# EAGLE design RFID_Controller (EAGLE 7.2.0)
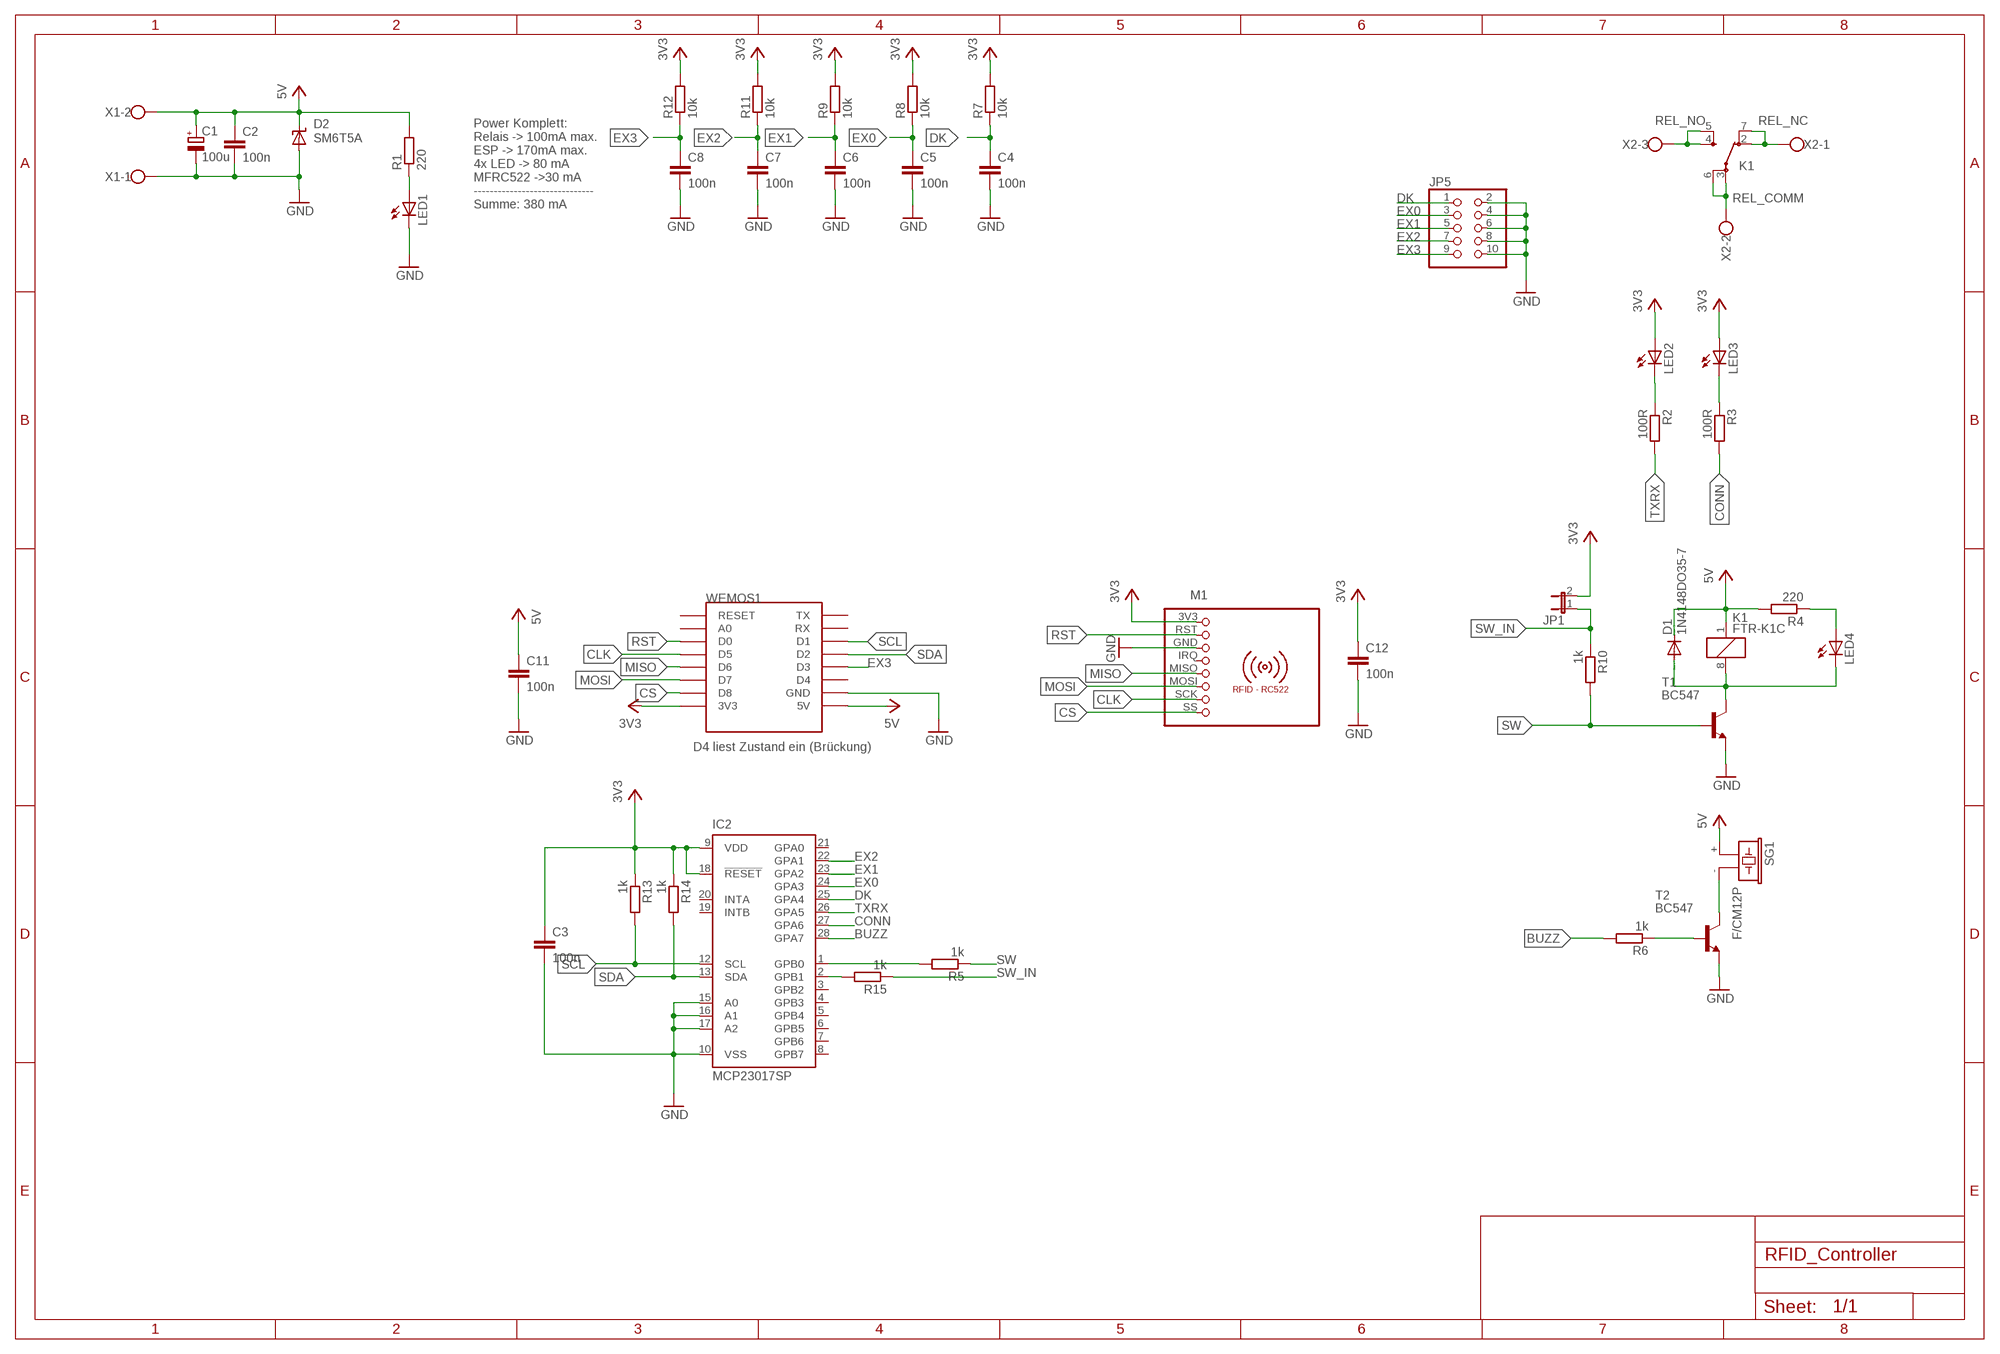
[diagram p0: schematic, sheet 1]

## Parts
C1  100u  CPOL-EUE2.5-7  [E2,5-7]
C2  100n  C-EU050-025X075  [C050-025X075]
C3  100n  C-EU050-025X075  [C050-025X075]
C4  100n  C-EU050-025X075  [C050-025X075]
C5  100n  C-EU050-025X075  [C050-025X075]
C6  100n  C-EU050-025X075  [C050-025X075]
C7  100n  C-EU050-025X075  [C050-025X075]
C8  100n  C-EU050-025X075  [C050-025X075]
C11  100n  C-EU050-025X075  [C050-025X075]
C12  100n  C-EU050-025X075  [C050-025X075]
D1  1N4148DO35-7  [DO35-7]
D2  SM6T5A  SUPPRESSOR-SMBJ  [SMBJ]
IC2  MCP23017SP  [DIL28-3]
JP1  JP1E  [JP1]
JP5  PINHD-2X5  [2X05]
K1  FTR-K1C  [FTR-K1C]
LED1  LED3MM  [LED3MM]
LED2  LED3MM  [LED3MM]
LED3  LED3MM  [LED3MM]
LED4  LED3MM  [LED3MM]
M1  RFID-RC522  [RFID-RC522]
R1  220  R-EU_0204/7  [0204/7]
R2  100R  R-EU_0204/7  [0204/7]
R3  100R  R-EU_0204/7  [0204/7]
R4  220  R-EU_0204/7  [0204/7]
R5  1k  R-EU_0204/7  [0204/7]
R6  1k  R-EU_0204/7  [0204/7]
R7  10k  R-EU_0204/7  [0204/7]
R8  10k  R-EU_0204/7  [0204/7]
R9  10k  R-EU_0204/7  [0204/7]
R10  1k  R-EU_0204/7  [0204/7]
R11  10k  R-EU_0204/7  [0204/7]
R12  10k  R-EU_0204/7  [0204/7]
R13  1k  R-EU_0204/7  [0204/7]
R14  1k  R-EU_0204/7  [0204/7]
R15  1k  R-EU_0204/7  [0204/7]
SG1  F/CM12P  [F/CM12P]
T1  BC547  [TO92]
T2  BC547  [TO92]
WEMOS1  WEMOS-D1-MINI  [WEMOS-D1-MINI]
X1  W237-102  [W237-102]
X2  W237-103  [W237-103]

## Nets
3V3: C3.1 C12.1 IC2.9(VDD) IC2.18(!RESET) JP1.2 LED2.A LED3.A M1.3V3 R7.2 R8.2 R9.2 R11.2 R12.2 R13.1 R14.1 WEMOS1.3V3
5V: C1.+ C2.1 C11.1 D1.C D2.C K1.1 R1.2 R4.2 SG1.+ WEMOS1.5V X1.2
BUZZ: IC2.28(GPA7) R6.2
CLK: M1.SCK WEMOS1.D5
CONN: IC2.27(GPA6) R3.2
CS: M1.SS WEMOS1.D8
DK: C4.1 IC2.25(GPA4) JP5.1 R7.1
EX0: C5.1 IC2.24(GPA3) JP5.3 R8.1
EX1: C6.1 IC2.23(GPA2) JP5.5 R9.1
EX2: C7.1 IC2.22(GPA1) JP5.7 R11.1
EX3: C8.1 JP5.9 R12.1 WEMOS1.D3
GND: C1.- C2.2 C3.2 C4.2 C5.2 C6.2 C7.2 C8.2 C11.2 C12.2 D2.A IC2.10(VSS) IC2.15(A0) IC2.16(A1) IC2.17(A2) JP5.2 JP5.4 JP5.6 JP5.8 JP5.10 LED1.K(C) M1.GND T1.1(E) T2.1(E) WEMOS1.GND X1.1
MISO: M1.MISO WEMOS1.D6
MOSI: M1.MOSI WEMOS1.D7
N$1: LED1.A R1.1
N$2: LED2.K(C) R2.1
N$3: LED3.K(C) R3.1
N$4: LED4.A R4.1
N$5: D1.A K1.8 LED4.K(C) T1.3(C)
N$6: R6.1 T2.2(B)
N$7: SG1.- T2.3(C)
N$8: IC2.1(GPB0) R5.2
N$9: IC2.2(GPB1) R15.2
REL_COMM [HV]: K1.3(-1:PA) K1.6(-1:PB) X2.2
REL_NC [HV]: K1.2(-1:OA) K1.7(-1:OB) X2.1
REL_NO [HV]: K1.4(-1:SA) K1.5(-1:SB) X2.3
RST: M1.RST WEMOS1.D0
SCL: IC2.12(SCL) R13.2 WEMOS1.D1
SDA: IC2.13(SDA) R14.2 WEMOS1.D2
SW: R5.1 R10.2 T1.2(B)
SW_IN: JP1.1 R10.1 R15.1
TXRX: IC2.26(GPA5) R2.2
Unconnected: IC2.3(GPB2) IC2.4(GPB3) IC2.5(GPB4) IC2.6(GPB5) IC2.7(GPB6) IC2.8(GPB7) IC2.19(INTB) IC2.20(INTA) IC2.21(GPA0) M1.IRQ WEMOS1.A0 WEMOS1.D4 WEMOS1.RESET WEMOS1.RX WEMOS1.TX

## Notes on the sheet
- Power Komplett:
  Relais -> 100mA max.
  ESP -> 170mA max.
  4x LED -> 80 mA
  MFRC522 ->30 mA
  ------------------------------
  Summe: 380 mA
- D4 liest Zustand ein (Brückung)

## Library data of the parts
C1 = rcl:CPOL-EU: POLARIZED CAPACITOR, European symbol
C2-C8 C11 C12 = rcl:C-EU: CAPACITOR, European symbol
D1 = diode:1N4148: DIODE high speed (Philips)
D2 = diode:SUPPRESSOR-: Suppressor diode
IC2 = microchip:MCP23017: http://ww1.microchip.com/downloads/en/DeviceDoc/21952a.pdf Source: http://ww1.microchip.com/downloads/en/DeviceDoc/21952a.pdf; MF: MICROCHIP; MPN: MCP23017-E/SP; OC_FARNELL: 1332088; OC_NEWARK: 31K2959
JP1 = jumper:JP1E: JUMPER
JP5 = pinhead:PINHD-2X5: PIN HEADER
K1 = relay:FTR-K1C: NETZRELAIS FTR-K1CK024W1XUM 16A/250VAC 1 Umschaltkontakt Distributor: Conrad Electronic Bestell Nr.: 504389-13 - 24V Source: http://www.produktinfo.conrad.com/datenblaetter/500000-524999/504384-da-01-de-NETZRELAIS_FTR_K1CK012W1XUM_16A_250VAC.pdf; OC_FARNELL: unknown; OC_NEWARK: unknown
LED1-LED4 = led:LED: LED OSRAM: - CHIPLED LG R971, LG N971, LY N971, LG Q971, LY Q971, LO R971, LY R971 LH N974, LH R974 LS Q976, LO Q976, LY Q976 LO Q996 - Hyper CHIPLED LW Q18S LB Q993, LB Q99A, LB R99A - SideLED LS A670, LO A670, LY A670, LG A670, LP A670 LB A673, LV A673, LT A673, LW A673 LH A674 LY A675 LS A676, LA A676, LO A676, LY A676, LW A676 LS A679, LY A679, LG A679 - Hyper Micro SIDELED® LS Y876, LA Y876, LO Y876, LY Y876 LT Y87S - SmartLED LW L88C, LW L88S LB L89C, LB L89S, LG L890 LS L89K, LO L89K, LY L89K LS L896, LA L896, LO L896, LY L896 - TOPLED LS T670, LO T670, LY T670, LG T670, LP T670 LSG T670, LSP T670, LSY T670, LOP T670, LYG T670 LG T671, LOG T671, LSG T671 LB T673, LV T673, LT T673, LW T673 LH T674 LS T676, LA T676, LO T676, LY T676, LB T676, LH T676, LSB T676, LW T676 LB T67C, LV T67C, LT T67C, LS T67K, LO T67K, LY T67K, LW E67C LS E67B, LA E67B, LO E67B, LY E67B, LB E67C, LV E67C, LT E67C LW T67C LS T679, LY T679, LG T679 LS T770, LO T770, LY T770, LG T770, LP T770 LB T773, LV T773, LT T773, LW T773 LH T774 LS E675, LA E675, LY E675, LS T675 LS T776, LA T776, LO T776, LY T776, LB T776 LHGB T686 LT T68C, LB T68C - Hyper Mini TOPLED® LB M676 - Mini TOPLED Santana® LG M470 LS M47K, LO M47K, LY M47K Source: http://www.osram.convergy.de LUXEON: - LUMILED® LXK2-PW12-R00, LXK2-PW12-S00, LXK2-PW14-U00, LXK2-PW14-V00 LXK2-PM12-R00, LXK2-PM12-S00, LXK2-PM14-U00 LXK2-PE12-Q00, LXK2-PE12-R00, LXK2-PE12-S00, LXK2-PE14-T00, LXK2-PE14-U00 LXK2-PB12-K00, LXK2-PB12-L00, LXK2-PB12-M00, LXK2-PB14-N00, LXK2-PB14-P00, LXK2-PB14-Q00 LXK2-PR12-L00, LXK2-PR12-M00, LXK2-PR14-Q00, LXK2-PR14-R00 LXK2-PD12-Q00, LXK2-PD12-R00, LXK2-PD12-S00 LXK2-PH12-R00, LXK2-PH12-S00 LXK2-PL12-P00, LXK2-PL12-Q00, LXK2-PL12-R00 Source: www.luxeon.com KINGBRIGHT: KA-3528ASYC Source: www.kingbright.com
M1 = mfrc522-module:RFID-RC522: RFID-RC522 MFRC-522 based breakout board
R1-R15 = rcl:R-EU_: RESISTOR, European symbol
SG1 = buzzer:F/CM12P: BUZZER Source: Buerklin; OC_FARNELL: unknown; OC_NEWARK: unknown
T1 T2 = transistor:BC547: NPN TRANSISTOR
WEMOS1 = esp8266modules:WEMOS-D1-MINI: WeMos.cc D1 mini ESP8266 module
X1 = con-wago-500:W237-102: WAGO SCREW CLAMP; MPN: 237-102; OC_FARNELL: unknown; OC_NEWARK: 70K9898
X2 = con-wago-500:W237-103: WAGO SCREW CLAMP; MPN: 237-103; OC_FARNELL: unknown; OC_NEWARK: 18M7116

## Net classes
1 HV: clearance 5 mm to class 0, clearance 1 mm

## Board
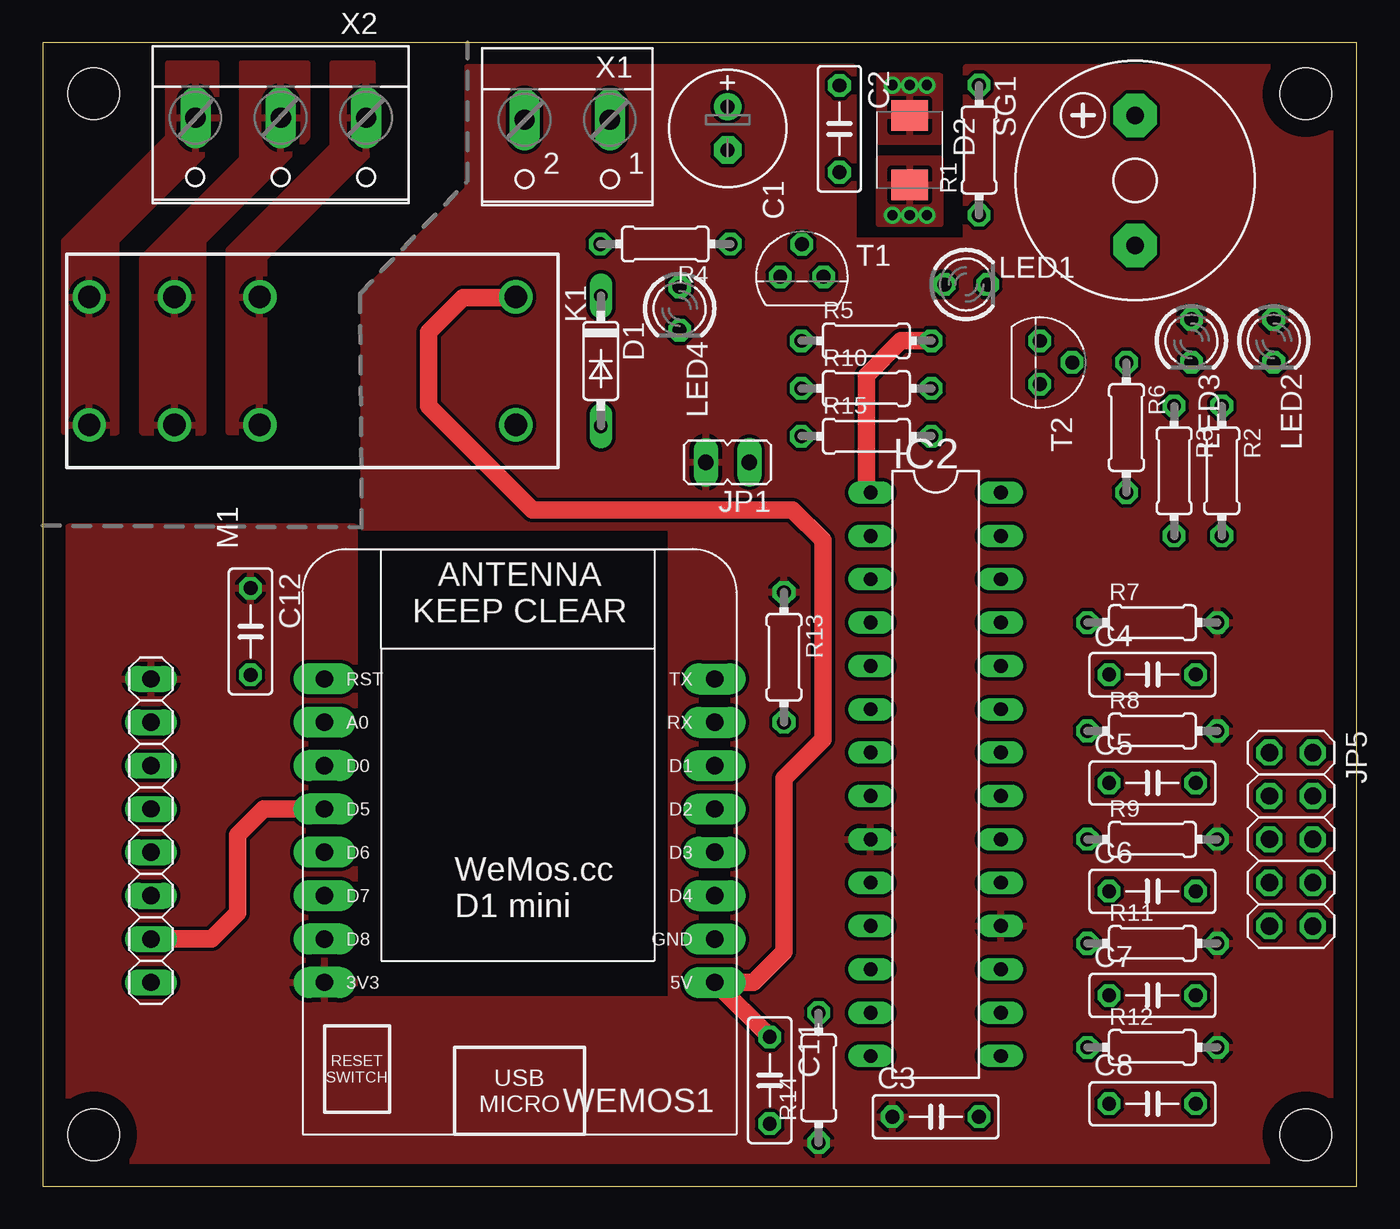
[diagram p1: board, top side]
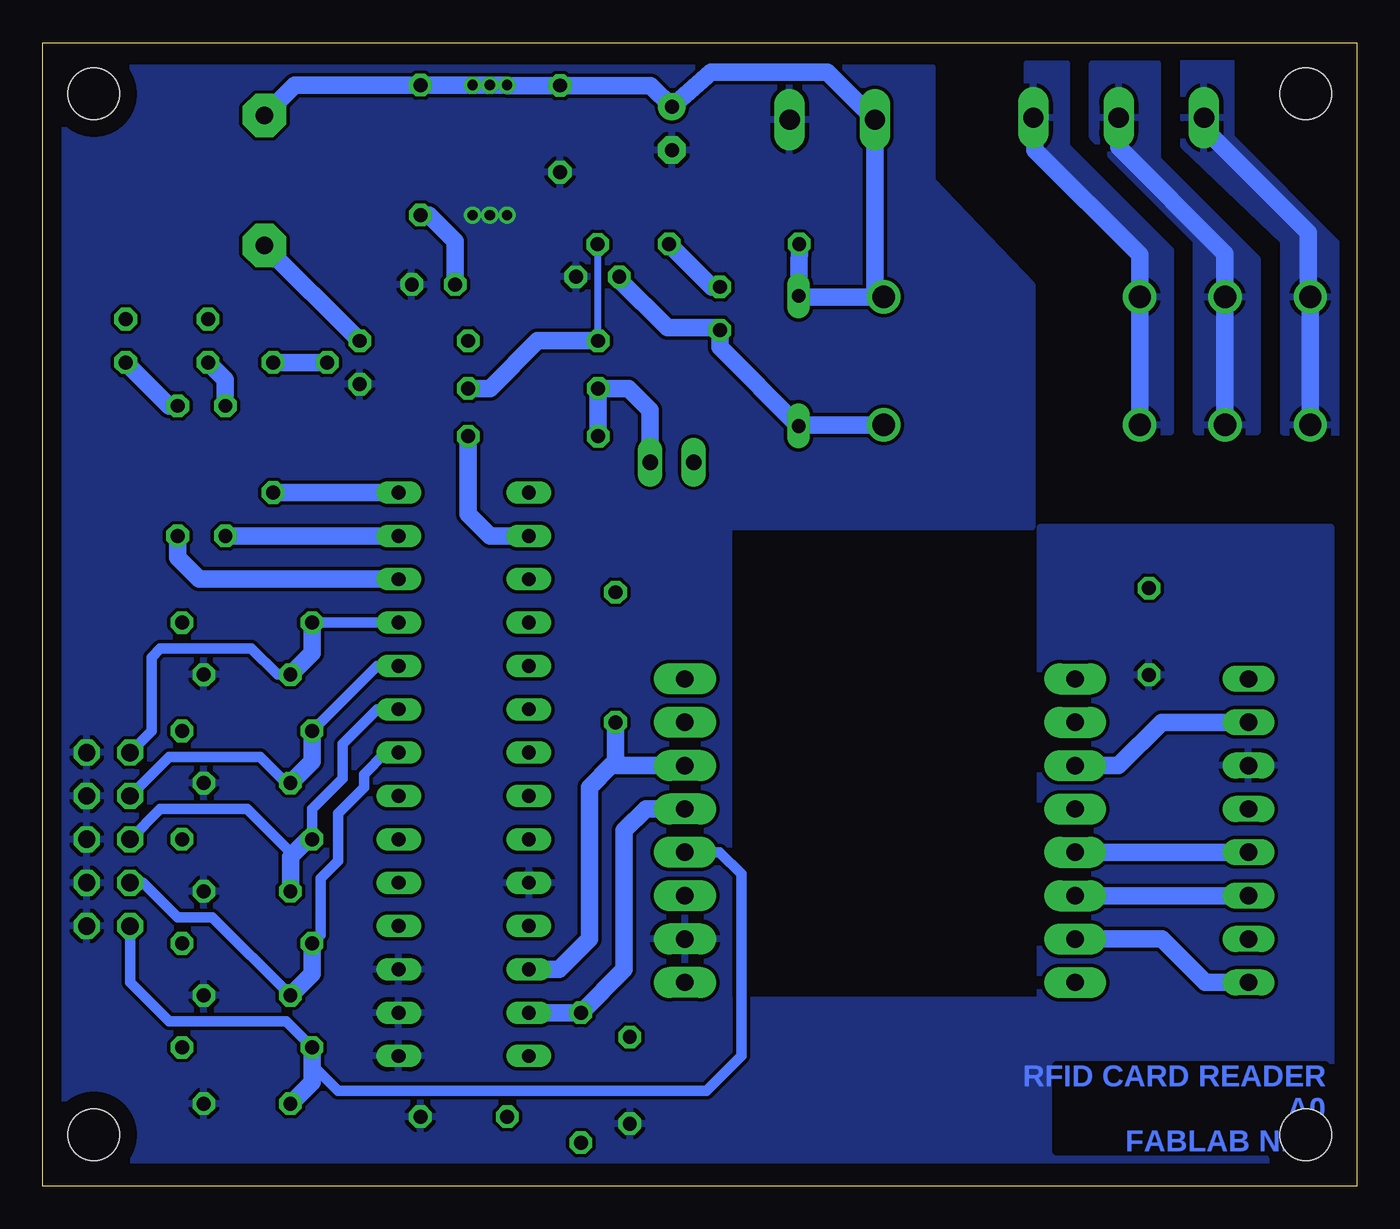
[diagram p2: board, bottom side, seen from below]

Size 77 x 67 mm. Coordinates in mm from the lower left corner, seen from the top.
Outline: 0,0 77,0 77,67 0,67 0,0
Copper layers (1*16): Top 0.035mm / dielectric 1.5mm / Bottom 0.035mm
Design rules "default *": minimum track width 10mil, minimum drill 0.2mm, track to track 8mil, track to pad 8mil, pad to pad 8mil, via to via 8mil, smd to smd 8mil, copper to edge 40mil, drill to drill 8mil, minimum pad ring 10mil, minimum via ring 8mil, stop-mask expansion 4mil, vias tented up to drill 0mil, thermal gap 10mil
Holes 3 mm at 3,64 74,64 74,3 3,3

### Footprints (pad centres in the part's own frame; a part is rotated, then mirrored left to right if it is on the bottom)
E2,5-7 = drill 0.813 pad 1.6: + -1.27,0 | drill 0.813 pad 1.6 octagon: - 1.27,0
C050-025X075 = drill 0.813 octagon: 1 -2.54,0; 2 2.54,0
DO35-7 = drill 0.813 long: A 3.81,0; C -3.81,0
SMBJ = smd 1.78 x 2.16: A 2.04,0; C -2.03,0
DIL28-3 = drill 0.813 long: 1 -16.51,-3.81; 2 -13.97,-3.81; 3 -11.43,-3.81; 4 -8.89,-3.81; 5 -6.35,-3.81; 6 -3.81,-3.81; 7 -1.27,-3.81; 8 1.27,-3.81; 9 3.81,-3.81; 10 6.35,-3.81; 11 8.89,-3.81; 12 11.43,-3.81; 13 13.97,-3.81; 14 16.51,-3.81; 15 16.51,3.81; 16 13.97,3.81; 17 11.43,3.81; 18 8.89,3.81; 19 6.35,3.81; 20 3.81,3.81; 21 1.27,3.81; 22 -1.27,3.81; 23 -3.81,3.81; 24 -6.35,3.81; 25 -8.89,3.81; 26 -11.43,3.81; 27 -13.97,3.81; 28 -16.51,3.81
JP1 = drill 0.914 long: 1 0,-1.27; 2 0,1.27
2X05 = drill 1.016 octagon: 1 -5.08,-1.27; 2 -5.08,1.27; 3 -2.54,-1.27; 4 -2.54,1.27; 5 0,-1.27; 6 0,1.27; 7 2.54,-1.27; 8 2.54,1.27; 9 5.08,-1.27; 10 5.08,1.27
FTR-K1C = drill 1.3 pad 1.93: 1 -12.5,-3.75; 2 2.5,-3.75; 3 7.5,-3.75; 4 12.5,-3.75; 5 12.5,3.75; 6 7.5,3.75; 7 2.5,3.75; 8 -12.5,3.75
LED3MM = drill 0.813 octagon: A -1.27,0; K 1.27,0
RFID-RC522 = drill 1.016 long: 3V3 -8.89,0; GND -3.81,0; IRQ -1.27,0; MISO 1.27,0; MOSI 3.81,0; RST -6.35,0; SCK 6.35,0; SS 8.89,0
0204/7 = drill 0.813 octagon: 1 -3.81,0; 2 3.81,0
F/CM12P = drill 1.016 pad 2.54 octagon: + 3.81,0; - -3.81,0
TO92 = drill 0.813 octagon: 1 1.27,0; 2 0,1.905; 3 -1.27,0
WEMOS-D1-MINI = drill 1.016 pad 1.829 long: 3V3 -10.16,-10.16; 5V 12.7,-10.16; A0 -10.16,5.08; D0 -10.16,2.54; D1 12.7,2.54; D2 12.7,0; D3 12.7,-2.54; D4 12.7,-5.08; D5 -10.16,0; D6 -10.16,-2.54; D7 -10.16,-5.08; D8 -10.16,-7.62; GND 12.7,-7.62; RESET -10.16,7.62; RX 12.7,5.08; TX 12.7,7.62
W237-102 = drill 1.194 long: 1 -2.5,-1.27; 2 2.5,-1.27
W237-103 = drill 1.194 long: 1 -5,-1.29; 2 0,-1.29; 3 5,-1.29

### Placement (x,y rotation side)
C1  40.13,61.98 270 top
C2  46.69,61.95 270 top
C3  52.32,4.06 0 top
C4  65.02,29.97 0 top
C5  65.02,23.62 0 top
C6  65.02,17.27 0 top
C7  65.02,11.18 0 top
C8  65.02,4.83 0 top
C11  42.6,6.2 270 top
C12  12.18,32.5 270 top
D1  32.7,48.35 270 top
D2  50.8,60.71 270 top
IC2  52.32,24.13 270 top
JP1  40.13,42.42 90 top
JP5  73.15,20.32 270 top
K1  15.22,48.35 180 top
LED1  54.1,52.83 0 top
LED2  72.14,49.53 270 top
LED3  67.31,49.53 270 top
LED4  37.32,51.42 270 top
M1  6.35,20.83 270 top
R1  54.86,60.71 90 top
R2  69.09,41.91 270 top
R3  66.29,41.91 270 top
R4  36.48,55.2 180 top
R5  48.26,49.53 0 top
R6  63.5,44.45 270 top
R7  65.02,33.02 0 top
R8  65.02,26.67 0 top
R9  65.02,20.32 0 top
R10  48.26,46.74 0 top
R11  65.02,14.22 0 top
R12  65.02,8.13 0 top
R13  43.43,30.99 270 top
R14  45.47,6.35 90 top
R15  48.26,43.94 0 top
SG1  64.01,58.93 90 top
T1  44.49,53.28 0 top
T2  58.42,48.26 270 top
WEMOS1  26.67,22.1 0 top
X1  30.73,61.21 180 top
X2  13.95,61.31 180 top

### Tracks (layer width: path | path; a pad name or v marks a point on that pad's centre or on a via)
3V3
  pour Top: 24.89,65.53 24.89,58.42 18.8,52.32 18.8,38.61 36.83,38.61 36.83,10.92 18.29,10.92 18.29,38.61 1.52,38.61 1.52,1.52 75.44,1.52 75.44,65.53 54.1,65.53 54.1,55.37 47.5,55.37 47.5,65.53
5V  (via drill 0.6)
  Top 1.016: K1.1 27.69,52.07 24.64,52.07 22.61,50.04 22.61,45.72 28.7,39.62 43.94,39.62 45.72,37.85 45.72,26.16 43.43,23.88 43.43,13.72 41.66,11.94 WEMOS1.5V 39.4,11.94 C11.1
  Bottom 1.016: R4.2 D1.C 32.64,52.1 K1.1 28.23,52.62 X1.2 31.03,65.28 37.85,65.28 C1.+ 41.38,64.49 C2.1 49.76,64.49 v49.78,64.52 v50.8,64.52 v51.82,64.52 R1.2 62.23,64.52 SG1.+
  pour Top: 49.02,65.02 49.02,61.21 52.58,61.21 52.58,65.02
BUZZ
  Bottom 1.016: R6.2 IC2.28
CLK
  Top 1.016: WEMOS1.D5 12.95,22.1 11.43,20.57 11.43,16 9.91,14.48 M1.SCK
CONN
  Bottom 1.016: IC2.27 R3.2
CS
  Bottom 1.016: WEMOS1.D8 11.43,14.48 8.89,11.94 M1.SS
DK
  Bottom 0.61: IC2.25 R7.1 | C4.1 63.25,29.97 64.77,31.5 70.1,31.5 70.61,30.99 70.61,26.67 JP5.1
  Bottom 1.016: R7.1 61.21,31.24 C4.1
EX0
  Bottom 0.61: IC2.24 57.4,30.48 R8.1 | C5.1 62.74,23.62 64.26,25.15 69.6,25.15 JP5.3
  Bottom 1.016: R8.1 61.21,24.89 C5.1
EX1
  Bottom 0.61: IC2.23 57.4,27.94 59.44,25.91 59.44,23.88 61.21,22.1 R9.1 | 62.36,19.43 65.02,22.1 70.1,22.1 JP5.5
  Bottom 1.016: R9.1 61.47,20.32 62.36,19.43 62.48,19.3 C6.1
EX2
  Bottom 0.61: IC2.22 56.9,25.4 58.17,24.13 58.17,23.37 59.69,21.84 59.69,19.05 60.71,18.03 60.71,14.73 R11.1 | C7.1 67.06,15.75 69.09,15.75 71.12,17.78 JP5.7
  Bottom 1.016: R11.1 61.21,12.45 C7.1
EX3
  Bottom 0.61: JP5.9 71.88,11.94 69.6,9.65 62.74,9.65 R12.1 61.21,7.11 59.69,5.59 38.1,5.59 36.07,7.62 36.07,18.29 37.34,19.56 WEMOS1.D3
  Bottom 1.016: R12.1 61.21,6.1 C8.1
GND  (via drill 0.6)
  other vias: 49.78,56.9 50.8,56.9 51.82,56.9
  pour Bottom: 24.89,65.53 24.89,58.93 19.05,52.83 19.05,38.61 36.83,38.61 36.83,10.92 18.54,10.92 18.54,38.61 1.52,38.61 1.52,1.52 75.69,1.52 75.69,65.53
  pour Top: 52.58,56.39 49.02,56.39 49.02,60.2 52.58,60.2
MISO
  Bottom 1.016: WEMOS1.D6 M1.MISO
MOSI
  Bottom 1.016: WEMOS1.D7 M1.MOSI
N$1
  Bottom 1.016: R1.1 54.36,56.9 52.83,55.37 LED1.A
N$2
  Bottom 1.016: R2.1 69.6,45.72 LED2.K
N$3
  Bottom 1.016: R3.1 66.29,47.24 LED3.K
N$4
  Bottom 1.016: LED4.A 37.78,52.69 R4.1
N$5
  Bottom 1.016: K1.8 32.64,44.6 D1.A 37.32,49.16 LED4.K 37.46,50.29 40.39,50.29 43.22,53.12 T1.3
N$6
  Bottom 1.016: R6.1 T2.2
N$7
  Bottom 1.016: SG1.- T2.3
N$8
  Top 1.016: R5.2 50.29,49.53 48.26,47.5 48.26,40.89 IC2.1
  Bottom 1.016: IC2.1 47.75,40.64
N$9
  Bottom 1.016: IC2.2 50.8,38.1 52.07,39.37 R15.2
REL_COMM
  Bottom 1.016: K1.6 K1.3 7.72,54.65 13.95,60.88 X2.2
  pour Bottom: 11.68,65.79 11.68,60.2 5.84,54.36 5.84,44.2 9.4,44.2 9.4,55.37 15.49,61.47 15.49,65.79
  pour Top: 11.68,65.79 11.68,60.2 5.84,54.36 5.84,44.2 9.4,44.2 9.4,55.37 15.49,61.47 15.49,65.79
REL_NC
  Bottom 1.016: K1.7 K1.2 12.72,54.57 18.85,60.7 18.85,62.9 X2.1
  pour Bottom: 10.92,44.2 12.95,44.2 12.95,54.61 19.3,61.21 19.3,65.79 17.02,65.79 17.02,60.96 10.92,54.86
  pour Top: 17.02,65.79 19.3,65.79 19.3,60.71 12.95,54.36 12.95,53.85 12.95,44.2 10.92,44.2 10.92,54.86 17.02,60.96
REL_NO
  Bottom 1.016: X2.3 8.95,61.98 2.85,55.87 2.85,52.23 K1.4 K1.5
  pour Bottom: 10.16,66.55 10.16,60.96 4.32,55.37 4.32,44.2 0.76,44.2 1.02,55.12 7.37,61.47 7.37,66.55
  pour Top: 10.16,65.79 7.37,65.79 7.37,61.47 1.27,55.37 1.27,44.2 4.32,44.2 4.32,55.37 10.16,61.21
RST
  Bottom 1.016: WEMOS1.D0 13.97,24.64 11.43,27.18 M1.RST
SCL
  Bottom 1.016: WEMOS1.D1 43.43,24.64 | 43.43,24.64 43.69,24.64 44.96,23.37 44.96,14.48 46.74,12.7 IC2.12 | R13.2 43.43,24.64
SDA
  Bottom 1.016: WEMOS1.D2 41.66,22.1 42.93,20.83 42.93,12.7 R14.2 IC2.13
SW
  Bottom 0.406: R5.1 44.45,55.15 T1.2
  Bottom 1.016: R10.2 50.8,46.74 48.01,49.53 R5.1
SW_IN
  Bottom 1.016: JP1.1 41.4,45.47 42.67,46.74 R10.1 R15.1
TXRX
  Bottom 1.016: IC2.26 67.82,35.56 69.09,36.83 R2.2

### Text on the board
Bottom: RFID CARD READER / A0 / FABLAB NBG